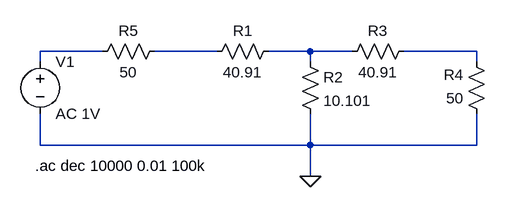
[diagram p0: schematic Ex1.asc]
Ex1.asc, the LTspice schematic file:
Version 4
SHEET 1 880 680
WIRE -64 96 -160 96
WIRE 112 96 16 96
WIRE 256 96 192 96
WIRE 320 96 256 96
WIRE 512 96 400 96
WIRE -160 112 -160 96
WIRE 256 112 256 96
WIRE 512 112 512 96
WIRE -160 240 -160 192
WIRE 256 240 256 192
WIRE 256 240 -160 240
WIRE 512 240 512 192
WIRE 512 240 256 240
WIRE 256 288 256 240
FLAG 256 288 0
SYMBOL res 208 80 R90
WINDOW 0 0 56 VBottom 2
WINDOW 3 32 56 VTop 2
SYMATTR InstName R1
SYMATTR Value 40.91
SYMBOL res 240 96 R0
SYMATTR InstName R2
SYMATTR Value 10.101
SYMBOL res 416 80 R90
WINDOW 0 0 56 VBottom 2
WINDOW 3 32 56 VTop 2
SYMATTR InstName R3
SYMATTR Value 40.91
SYMBOL res 528 208 R180
WINDOW 0 36 76 Left 2
WINDOW 3 36 40 Left 2
SYMATTR InstName R4
SYMATTR Value 50
SYMBOL res -80 112 R270
WINDOW 0 32 56 VTop 2
WINDOW 3 0 56 VBottom 2
SYMATTR InstName R5
SYMATTR Value 50
SYMBOL voltage -160 96 R0
WINDOW 123 0 0 Left 0
WINDOW 39 0 0 Left 0
SYMATTR InstName V1
SYMATTR Value AC 1V
TEXT -168 272 Left 2 !.ac dec 10000 0.01 100k

The netlist it stands for:
* Ex1.asc
R1 N003 N002 40.91
R2 N003 0 10.101
R3 N004 N003 40.91
R4 0 N004 50
R5 N001 N002 50
V1 N001 0 AC 1V
.ac dec 10000 0.01 100k
.backanno
.end